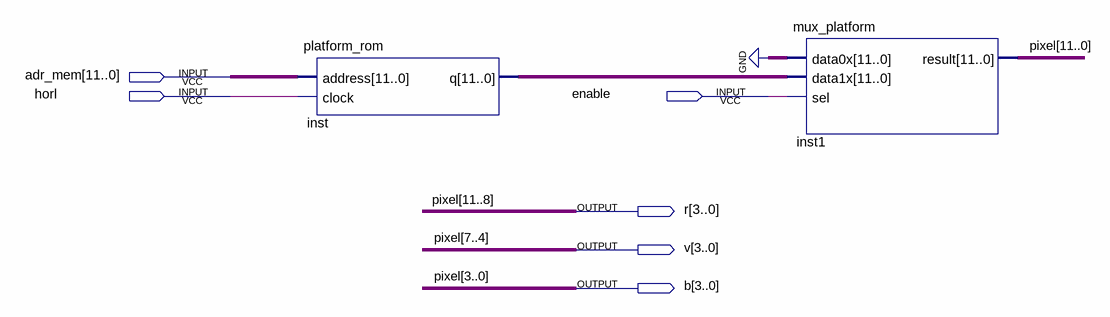
[diagram p0: schematic sheet]
// Quartus schematic memory_platform.bdf as structural Verilog: 2 symbols, 6 pins
module memory_platform (
  input  [11:0] adr_mem,
  input  horl,
  input  enable,
  output [3:0] r,
  output [3:0] v,
  output [3:0] b
);

  wire [11:0] inst_q;

  platform_rom inst (.address(adr_mem), .clock(horl), .q(inst_q));
  mux_platform inst1 (.data0x({12{1'b0}}), .data1x(inst_q), .sel(enable), .result({r, v, b}));

  // Other names for the same wires on the sheet: pixel[11:0] = {r, v, b}
endmodule
